# EAGLE design untitled (EAGLE 5.11)
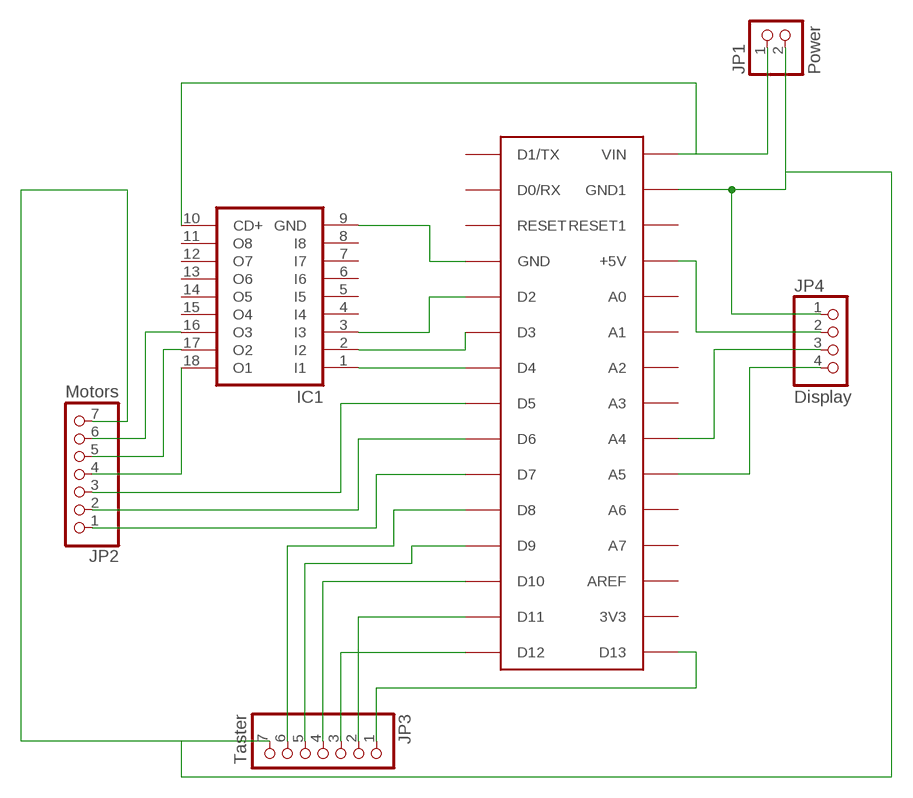
[diagram p0: schematic, sheet 1]

## Parts
IC1  ULN2803A  [DIL18]
JP1  Power  PINHD-1X2  [1X02]
JP2  Motors  PINHD-1X7  [1X07]
JP3  Taster  PINHD-1X7  [1X07]
JP4  Display  PINHD-1X4  [1X04]
U$1  ARDUINONANO  [PDIP-32]

## Nets
N$1: IC1.10(CD+) JP1.1 U$1.VIN
N$3: IC1.1(I1) U$1.D4
N$4: IC1.2(I2) U$1.D3
N$5: IC1.3(I3) U$1.D2
N$6: JP3.5 U$1.D9
N$7: IC1.18(O1) JP2.4
N$8: IC1.17(O2) JP2.5
N$9: IC1.16(O3) JP2.6
N$10: JP1.2 JP2.7 JP3.7 JP4.1 U$1.GND1
N$11: JP2.3 U$1.D5
N$12: JP2.2 U$1.D6
N$13: JP2.1 U$1.D7
N$14: JP3.6 U$1.D8
N$15: JP3.4 U$1.D10
N$16: JP3.3 U$1.D12
N$17: JP3.2 U$1.D11
N$18: JP3.1 U$1.D13
N$19: JP4.2 U$1.+5V
N$20: JP4.3 U$1.A4
N$21: JP4.4 U$1.A5
N$22: IC1.9(GND) U$1.GND
Unconnected: IC1.4(I4) IC1.5(I5) IC1.6(I6) IC1.7(I7) IC1.8(I8) IC1.11(O8) IC1.12(O7) IC1.13(O6) IC1.14(O5) IC1.15(O4) U$1.3V3 U$1.A0 U$1.A1 U$1.A2 U$1.A3 U$1.A6 U$1.A7 U$1.AREF U$1.D0/RX U$1.D1/TX U$1.RESET U$1.RESET1

## Library data of the parts
IC1 = uln-udn:ULN2803A: DRIVER ARRAY
JP1 = pinhead:PINHD-1X2: PIN HEADER
JP2 JP3 = pinhead:PINHD-1X7: PIN HEADER
JP4 = pinhead:PINHD-1X4: PIN HEADER
U$1 = jet-lib:ARDUINONANO

## Board
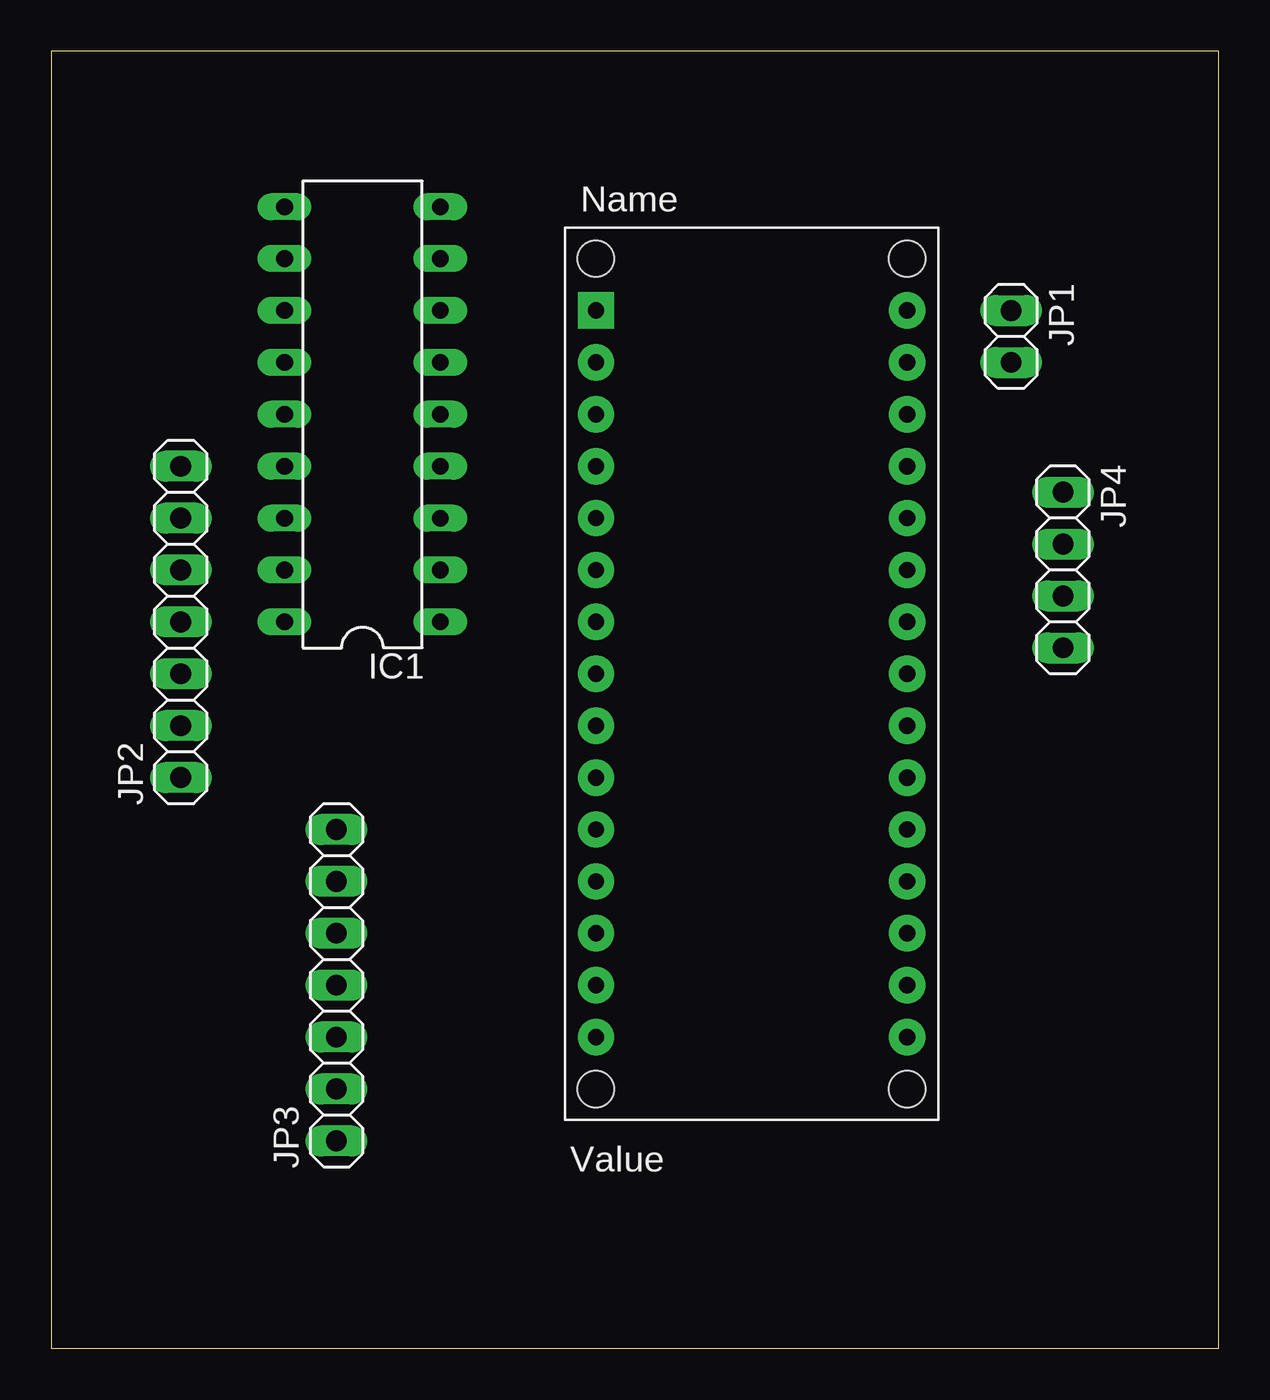
[diagram p1: board, top side]
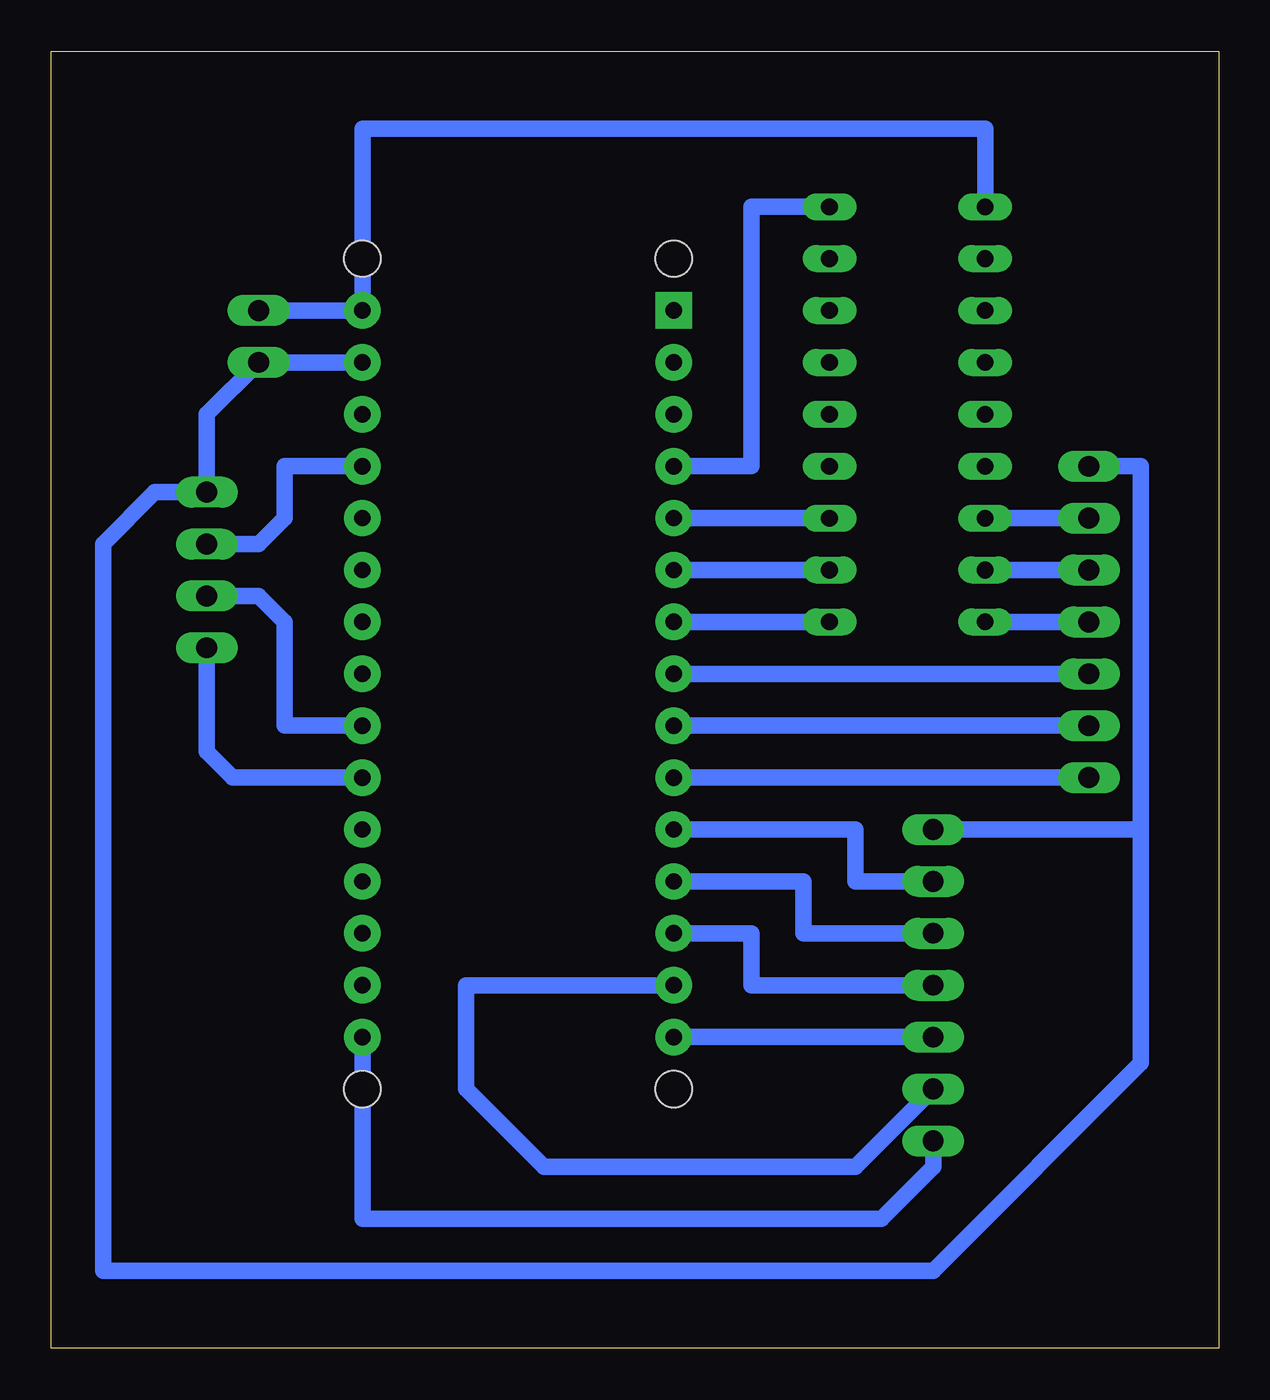
[diagram p2: board, bottom side, seen from below]

Size 57.15 x 63.5 mm. Coordinates in mm from the lower left corner, seen from the top.
Copper layers (1*16): Top 0.035mm / dielectric 1.5mm / Bottom 0.035mm
Design rules "default": minimum track width 10mil, minimum drill 24mil, track to track 8mil, track to pad 8mil, pad to pad 8mil, via to via 8mil, smd to smd 8mil, copper to edge 40mil, drill to drill 8mil, minimum pad ring 10mil, minimum via ring 8mil, stop-mask expansion 4mil, vias tented up to drill 0mil, thermal gap 10mil

### Footprints (pad centres in the part's own frame; a part is rotated, then mirrored left to right if it is on the bottom)
DIL18 = drill 0.813 long: 1 -10.16,-3.81; 2 -7.62,-3.81; 3 -5.08,-3.81; 4 -2.54,-3.81; 5 0,-3.81; 6 2.54,-3.81; 7 5.08,-3.81; 8 7.62,-3.81; 9 10.16,-3.81; 10 10.16,3.81; 11 7.62,3.81; 12 5.08,3.81; 13 2.54,3.81; 14 0,3.81; 15 -2.54,3.81; 16 -5.08,3.81; 17 -7.62,3.81; 18 -10.16,3.81
1X02 = drill 1.016 long: 1 -1.27,0; 2 1.27,0
1X07 = drill 1.016 long: 1 -7.62,0; 2 -5.08,0; 3 -2.54,0; 4 0,0; 5 2.54,0; 6 5.08,0; 7 7.62,0
1X04 = drill 1.016 long: 1 -3.81,0; 2 -1.27,0; 3 1.27,0; 4 3.81,0
PDIP-32 = drill 0.8 pad 1.778 round: 3V3 15.24,-35.56; +5V 15.24,-10.16; A0 15.24,-12.7; A1 15.24,-15.24; A2 15.24,-17.78; A3 15.24,-20.32; A4 15.24,-22.86; A5 15.24,-25.4; A6 15.24,-27.94; A7 15.24,-30.48; AREF 15.24,-33.02; D0/RX 0,-5.08; D2 0,-12.7; D3 0,-15.24; D4 0,-17.78; D5 0,-20.32; D6 0,-22.86; D7 0,-25.4; D8 0,-27.94; D9 0,-30.48; D10 0,-33.02; D11 0,-35.56; D12 0,-38.1; D13 15.24,-38.1; GND 0,-10.16; GND1 15.24,-5.08; RESET 0,-7.62; RESET1 15.24,-7.62; VIN 15.24,-2.54 | drill 0.8 pad 1.778 square: D1/TX 0,-2.54 | hole 1.778: 0,0; 0,-40.64; 15.24,-40.64; 15.24,0

### Placement (x,y rotation side)
IC1  15.24,45.72 90 top
JP1  46.99,49.53 270 top
JP2  6.35,35.56 90 top
JP3  13.97,17.78 90 top
JP4  49.53,38.1 270 top
U$1  26.67,53.34 0 top

### Tracks (layer width: path | path; a pad name or v marks a point on that pad's centre or on a via)
N$1
  Bottom 0.813: IC1.10 11.43,59.69 41.91,59.69 U$1.VIN JP1.1
N$3
  Bottom 0.813: IC1.1 U$1.D4
N$4
  Bottom 0.813: U$1.D3 IC1.2
N$5
  Bottom 0.813: IC1.3 U$1.D2
N$6
  Bottom 0.813: JP3.5 20.32,20.32 20.32,22.86 U$1.D9
N$7
  Bottom 0.813: JP2.4 IC1.18
N$8
  Bottom 0.813: IC1.17 JP2.5
N$9
  Bottom 0.813: JP2.6 IC1.16
N$10
  Bottom 0.813: 3.81,25.4 3.81,43.18 JP2.7 | 3.81,25.4 JP3.7 | U$1.GND1 JP1.2 49.53,45.72 JP4.1 52.07,41.91 54.61,39.37 54.61,3.81 13.97,3.81 3.81,13.97 3.81,25.4
N$11
  Bottom 0.813: JP2.3 U$1.D5
N$12
  Bottom 0.813: JP2.2 U$1.D6
N$13
  Bottom 0.813: JP2.1 U$1.D7
N$14
  Bottom 0.813: JP3.6 17.78,22.86 17.78,25.4 U$1.D8
N$15
  Bottom 0.813: JP3.4 22.86,17.78 22.86,20.32 U$1.D10
N$16
  Bottom 0.813: JP3.3 U$1.D12
N$17
  Bottom 0.813: JP3.2 17.78,8.89 33.02,8.89 36.83,12.7 36.83,17.78 U$1.D11
N$18
  Bottom 0.813: JP3.1 13.97,8.89 16.51,6.35 41.91,6.35 U$1.D13
N$19
  Bottom 0.813: JP4.2 46.99,39.37 45.72,40.64 45.72,43.18 U$1.+5V
N$20
  Bottom 0.813: JP4.3 46.99,36.83 45.72,35.56 45.72,30.48 U$1.A4
N$21
  Bottom 0.813: JP4.4 49.53,29.21 48.26,27.94 U$1.A5
N$22
  Bottom 0.813: U$1.GND 22.86,43.18 22.86,55.88 IC1.9